# Altium schematic sheet Description Page.SchDoc
size A4
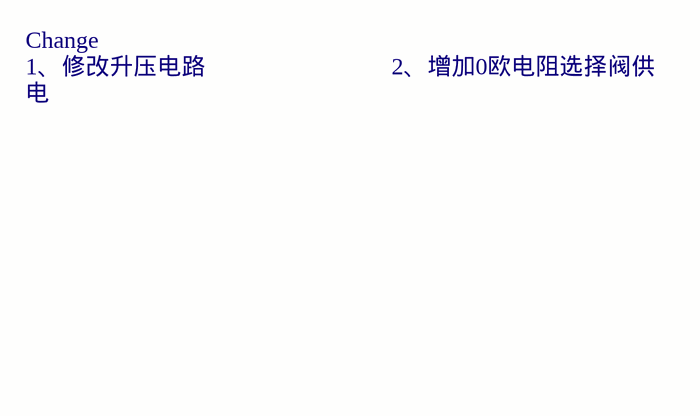
[diagram p0: Description Page.SchDoc]

## Notes on the sheet
- Change                                                                                                                                          1、修改升压电路                               2、增加0欧电阻选择阀供电